# Altium schematic sheet CirkPic.SchDoc
size A4
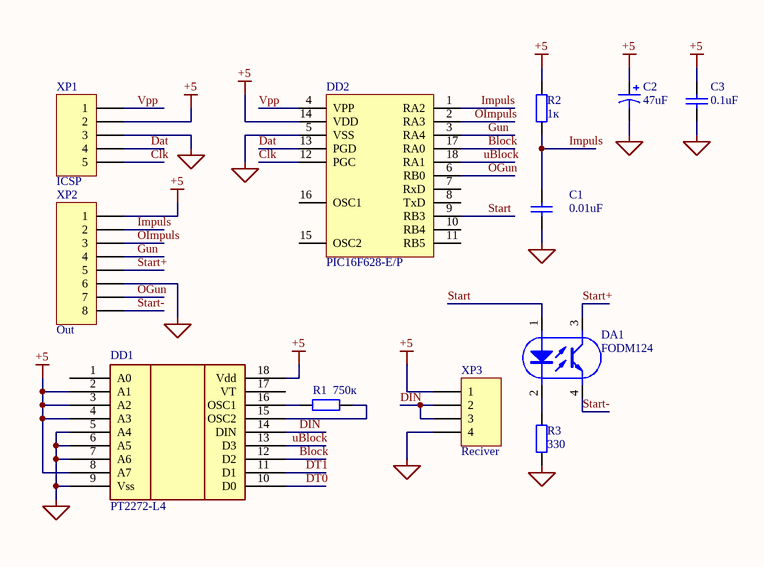
[diagram p0: CirkPic.SchDoc]

## Parts
C1  value 0.01uF  [CAPC2012N]  (hidden comment: Cap)
C2  value 47uF  [TC3528-1411]  (hidden comment: Cap Pol1)
C3  value 0.1uF  [CAPC2012N]  (hidden comment: Cap)
DA1  value FODM124  [DIP-4]  (hidden comment: Optoisolator2)
DD1  PT2272-L4  [DIP-18]
DD2  PIC16F628-E/P  [DIP-18]
R1  value 750к  [RESC2012N]  (hidden comment: Res2)
R2  value 1к  [RESC2012N]  (hidden comment: Res2)
R3  value 330  [RESC3216N]  (hidden comment: Res2)
XP1  ICSP  [HDR1X5]
XP2  Out  [HDR1X8]
XP3  Reciver  [HDR1X4]

## Nets
+5: C2.1 C3.2 DD1.2(A1) DD1.3(A2) DD1.4(A3) DD1.8(A7) DD1.18(Vdd) DD2.14(VDD) R2.2 XP1.2 XP2.1 XP3.1
GND: C1.1 C2.2 C3.1 DD1.5(A4) DD1.6(A5) DD1.7(A6) DD1.9(Vss) DD2.5(VSS) R3.2 XP1.3 XP2.6 XP3.4
Block: DD1.12(D2) DD2.17(RA0)
Clk: DD2.12(PGC) XP1.5
Dat: DD2.13(PGD) XP1.4
DIN: DD1.14(DIN) XP3.2 XP3.3
DT0: DD1.10(D0)
DT1: DD1.11(D1)
Gun: DD2.3(RA4) XP2.4
Impuls: C1.2 DD2.1(RA2) R2.1 XP2.2
OGun: DD2.6(RB0) XP2.7
OImpuls: DD2.2(RA3) XP2.3
Start: DA1.1(A) DD2.9(RB3)
Start+: DA1.3(C) XP2.5
Start-: DA1.4(E) XP2.8
uBlock: DD1.13(D3) DD2.18(RA1)
Vpp: DD2.4(VPP) XP1.1
NetDA1_2: DA1.2(K) R3.1
NetDD1_15: DD1.15(OSC2) R1.2
NetDD1_16: DD1.16(OSC1) R1.1

Not connected (* = marked no-connect by the designer): DD1 1(A0) 17(VT); DD2 7(RxD) 8(TxD) 10(RB4) 11(RB5) 15(OSC2) 16(OSC1)

## Library data of the parts
C1 C3 = Cap: Capacitor; Published: 8-Jun-2000; LatestRevisionDate: 17-Jul-2002; LatestRevisionNote: Re-released for DXP Platform.; PackageReference: RAD-0.3; Publisher: Altium Limited; PackageDescription: Radial Cap, Thru-Hole; 2 Leads; 0.3 in Pin Spacing
C2 = Cap Pol1: Polarized Capacitor (Radial); Published: 8-Jun-2000; LatestRevisionDate: 17-Jul-2002; LatestRevisionNote: Re-released for DXP Platform.; PackageReference: RB7.6-15; Publisher: Altium Limited; PackageDescription: Polarized Capacitor (Radial); 2 Leads
DA1 = Optoisolator2: 5 Pin Mini Flat Pack Optocoupler; Published: 24-Mar-1999; LatestRevisionDate: 04-Mar-2005; LatestRevisionNote: PCB Footprint replaced, Sch pins re-numbered.; DatasheetVersion: Apr-2004; PackageReference: SOP5(6); Publisher: Altium Limited
DD1 = PT2272
DD2 = PIC16F628A-E/P: FLASH-Based 8-Bit CMOS Microcontroller with nanoWatt Technology, 2K (x14-Bit words) FLASH, 224 Bytes SRAM, 18-Pin PDIP, 3.0 to 5.5V Supply Range, Extended Temperature; Published: 11-Oct-2004; LatestRevisionDate: 29-Jan-2009; LatestRevisionNote: Sch. layout revised. 3D Model Removed.; DatasheetVersion: revF, Mar-2007; PackageVersion: revBB, Aug-2009; PackageReference: PDIP300-P18; Publisher: Altium Limited; PackageDescription: 18-Lead Plastic Dual In-Line (P) - 300 mil Body [PDIP]; Supplier 1: Digi-Key; Supplier Part Number 1: PIC16F628A-E/P-ND; Code_JEDEC: MS-001; ComponentLink1Description: Datasheet; ComponentLink1URL: http://ww1.microchip.com/downloads/en/DeviceDoc/40044F.pdf; ComponentLink2Description: Packaging Specification; ComponentLink2URL: http://www.microchip.com/stellent/groups/techpub_sg/documents/packagingspec/en012702.pdf; ComponentLink3Description: Microchip.com Home; ComponentLink3URL: http://www.microchip.com/
R1-R3 = Res2: Resistor; Published: 8-Jun-2000; LatestRevisionDate: 17-Jul-2002; LatestRevisionNote: Re-released for DXP Platform.; PackageReference: AXIAL-0.4; Publisher: Altium Limited; PackageDescription: Axial Device, Thru-Hole; 2 Leads; 0.4 in Pin Spacing
XP1 = Header 5: Header, 5-Pin; LatestRevisionDate: 17-Jul-2002; LatestRevisionNote: Re-released for DXP Platform.; Publisher: Altium Limited
XP2 = Header 8: Header, 8-Pin; LatestRevisionDate: 17-Jul-2002; LatestRevisionNote: Re-released for DXP Platform.; Publisher: Altium Limited
XP3 = Header 4: Header, 4-Pin; LatestRevisionDate: 17-Jul-2002; LatestRevisionNote: Re-released for DXP Platform.; Publisher: Altium Limited